# EAGLE design remote_V0_04_ (EAGLE 6.2)
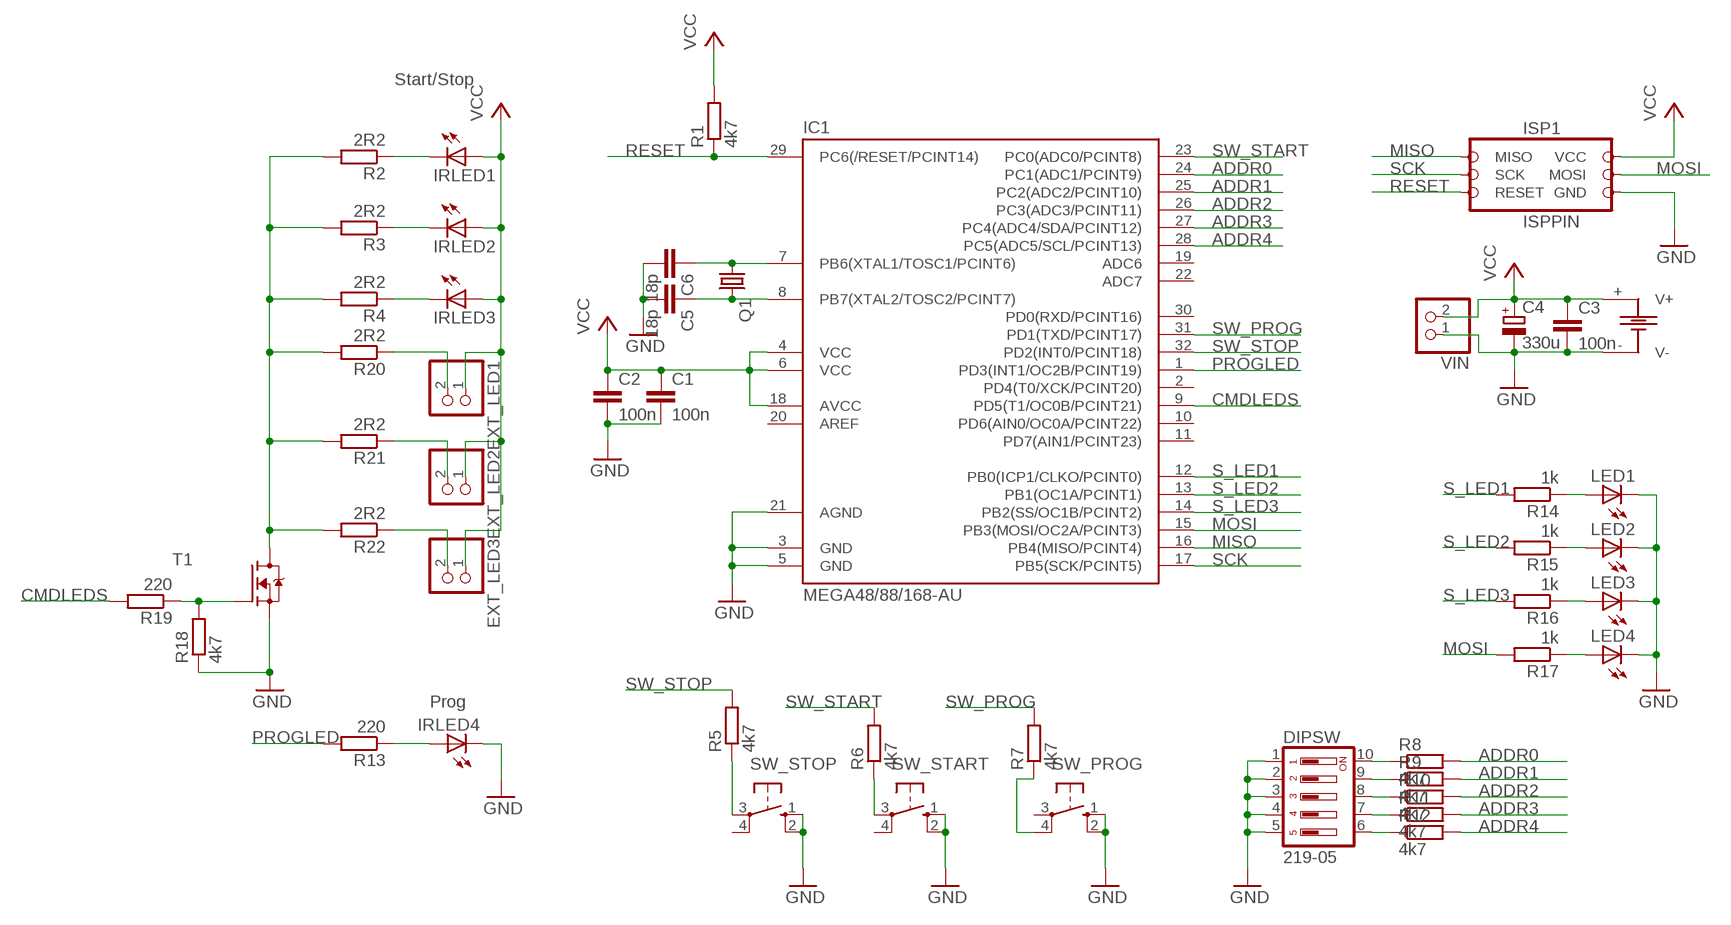
[diagram p0: schematic, sheet 1]

## Parts
B1  BATTERY_HOLDER_1  [BAT_HOLDER_1]
C1  100n  C-EUC0805WP  [C0805WP]
C2  100n  C-EUC0805WP  [C0805WP]
C3  100n  C-EUC0805WP  [C0805WP]
C4  330u  CPOL-EUSANYO_SMD_C6  [SANYO-OSCON_SMD_C6]
C5  18p  C-EUC0805WP  [C0805WP]
C6  18p  C-EUC0805WP  [C0805WP]
DIPSW  219-05  [CTS-219-05]
EXT_LED1  PINHD-1X2LONG  [1X2LONG]
EXT_LED2  PINHD-1X2LONG  [1X2LONG]
EXT_LED3  PINHD-1X2LONG  [1X2LONG]
IC1  MEGA48/88/168-AU  [TQFP32-08]
IRLED1  LEDLED5MMH  [LED5MMH]
IRLED2  LEDLED5MMH  [LED5MMH]
IRLED3  LEDLED5MMH  [LED5MMH]
IRLED4  LEDLED5MMH  [LED5MMH]
ISP1  ISPPIN  [2X03]
LED1  LED0805  [LED_0805]
LED2  LED0805  [LED_0805]
LED3  LED0805  [LED_0805]
LED4  LED0805  [LED_0805]
Q1  CRYSTALHC49S  [HC49/S]
R1  4k7  R-EU_R0805WP  [R0805WP]
R2  2R2  R-EU_R0805WP  [R0805WP]
R3  2R2  R-EU_R0805WP  [R0805WP]
R4  2R2  R-EU_R0805WP  [R0805WP]
R5  4k7  R-EU_R0805WP  [R0805WP]
R6  4k7  R-EU_R0805WP  [R0805WP]
R7  4k7  R-EU_R0805WP  [R0805WP]
R8  4k7  R-EU_R0805WP  [R0805WP]
R9  4k7  R-EU_R0805WP  [R0805WP]
R10  4k7  R-EU_R0805WP  [R0805WP]
R11  4k7  R-EU_R0805WP  [R0805WP]
R12  4k7  R-EU_R0805WP  [R0805WP]
R13  220  R-EU_R0805WP  [R0805WP]
R14  1k  R-EU_R0805WP  [R0805WP]
R15  1k  R-EU_R0805WP  [R0805WP]
R16  1k  R-EU_R0805WP  [R0805WP]
R17  1k  R-EU_R0805WP  [R0805WP]
R18  4k7  R-EU_R0805WP  [R0805WP]
R19  220  R-EU_R0805WP  [R0805WP]
R20  2R2  R-EU_R0805WP  [R0805WP]
R21  2R2  R-EU_R0805WP  [R0805WP]
R22  2R2  R-EU_R0805WP  [R0805WP]
SW_PROG  10-XX  [B3F-10XX]
SW_START  10-XX  [B3F-10XX]
SW_STOP  10-XX  [B3F-10XX]
T1  MOSFET_N_SOT23  [SOT23]
VIN  PINHD-1X2  [1X02]

## Nets
ADDR0: IC1.24(PC1(ADC1/PCINT9)) R8.2
ADDR1: IC1.25(PC2(ADC2/PCINT10)) R9.2
ADDR2: IC1.26(PC3(ADC3/PCINT11)) R10.2
ADDR3: IC1.27(PC4(ADC4/SDA/PCINT12)) R11.2
ADDR4: IC1.28(PC5(ADC5/SCL/PCINT13)) R12.2
CMDLEDS: IC1.9(PD5(T1/OC0B/PCINT21)) R19.2
GND: B1.-(V-) C1.2 C2.2 C3.2 C4.- C5.2 C6.2 DIPSW.1 DIPSW.2 DIPSW.3 DIPSW.4 DIPSW.5 IC1.3(GND) IC1.5(GND) IC1.21(AGND) IRLED4.P$2(C) ISP1.6(GND) LED1.C LED2.C LED3.C LED4.C R18.1 SW_PROG.1(S) SW_PROG.2(S1) SW_START.1(S) SW_START.2(S1) SW_STOP.1(S) SW_STOP.2(S1) T1.2(S) VIN.1
MISO: IC1.16(PB4(MISO/PCINT4)) ISP1.1(MISO)
MOSI: IC1.15(PB3(MOSI/OC2A/PCINT3)) ISP1.4(MOSI) R17.2
N$1: IRLED1.P$2(C) R2.1
N$2: IRLED2.P$2(C) R3.1
N$3: IRLED3.P$2(C) R4.1
N$4: DIPSW.10 R8.1
N$5: DIPSW.9 R9.1
N$6: DIPSW.8 R10.1
N$7: DIPSW.7 R11.1
N$8: DIPSW.6 R12.1
N$9: R5.1 SW_STOP.3(P)
N$10: R6.1 SW_START.3(P)
N$11: R7.1 SW_PROG.4(P1)
N$12: IRLED4.P$1(A) R13.1
N$13: R18.2 R19.1 T1.1(G)
N$14: LED1.A R14.1
N$15: LED2.A R15.1
N$16: LED3.A R16.1
N$17: LED4.A R17.1
N$18: C6.1 IC1.7(PB6(XTAL1/TOSC1/PCINT6)) Q1.1
N$19: EXT_LED1.2 R20.1
N$20: EXT_LED2.2 R21.1
N$21: R2.2 R3.2 R4.2 R20.2 R21.2 R22.2 T1.3(D)
N$22: EXT_LED3.2 R22.1
N$23: C5.1 IC1.8(PB7(XTAL2/TOSC2/PCINT7)) Q1.2
PROGLED: IC1.1(PD3(INT1/OC2B/PCINT19)) R13.2
RESET: IC1.29(PC6(/RESET/PCINT14)) ISP1.5(RESET) R1.1
S_LED1: IC1.12(PB0(ICP1/CLKO/PCINT0)) R14.2
S_LED2: IC1.13(PB1(OC1A/PCINT1)) R15.2
S_LED3: IC1.14(PB2(SS/OC1B/PCINT2)) R16.2
SCK: IC1.17(PB5(SCK/PCINT5)) ISP1.3(SCK)
SW_PROG: IC1.31(PD1(TXD/PCINT17)) R7.2
SW_START: IC1.23(PC0(ADC0/PCINT8)) R6.2
SW_STOP: IC1.32(PD2(INT0/PCINT18)) R5.2
VCC: B1.+(V+) C1.1 C2.1 C3.1 C4.+ EXT_LED1.1 EXT_LED2.1 EXT_LED3.1 IC1.4(VCC) IC1.6(VCC) IC1.18(AVCC) IRLED1.P$1(A) IRLED2.P$1(A) IRLED3.P$1(A) ISP1.2(VCC) R1.2 VIN.2
Unconnected: IC1.2(PD4(T0/XCK/PCINT20)) IC1.10(PD6(AIN0/OC0A/PCINT22)) IC1.11(PD7(AIN1/PCINT23)) IC1.19(ADC6) IC1.20(AREF) IC1.22(ADC7) IC1.30(PD0(RXD/PCINT16)) SW_PROG.3(P) SW_START.4(P1) SW_STOP.4(P1)

## Notes on the sheet
- Start/Stop
- Prog

## Library data of the parts
B1 = CRF:BATTERY_HOLDER: A battery holder A standard battery holder for AA-batteries (R6). http://se.mouser.com/ProductDetail/Eagle-Plastic-Devices/12BH212P-GR/?qs=GYzcNiWpw3f5BXsEPEtWIg%3d%3d
C1-C3 C5 C6 = rcl:C-EU: CAPACITOR, European symbol
C4 = rcl:CPOL-EU: POLARIZED CAPACITOR, European symbol
DIPSW = switch-dil:219-05*: Surface Mount DIP Switch Series 219 SMT CTS Electronic Components Sourc: www.ctscorp.com; OC_FARNELL: unknown; OC_NEWARK: unknown
EXT_LED1-EXT_LED3 = CRF:PINHD-1X2
IC1 = avr-7:MEGA48/88/168
IRLED1-IRLED4 = led:LED: LED OSRAM: - CHIPLED LG R971, LG N971, LY N971, LG Q971, LY Q971, LO R971, LY R971 LH N974, LH R974 LS Q976, LO Q976, LY Q976 LO Q996 - Hyper CHIPLED LW Q18S LB Q993, LB Q99A, LB R99A - SideLED LS A670, LO A670, LY A670, LG A670, LP A670 LB A673, LV A673, LT A673, LW A673 LH A674 LY A675 LS A676, LA A676, LO A676, LY A676, LW A676 LS A679, LY A679, LG A679 - Hyper Micro SIDELED® LS Y876, LA Y876, LO Y876, LY Y876 LT Y87S - SmartLED LW L88C, LW L88S LB L89C, LB L89S, LG L890 LS L89K, LO L89K, LY L89K LS L896, LA L896, LO L896, LY L896 - TOPLED LS T670, LO T670, LY T670, LG T670, LP T670 LSG T670, LSP T670, LSY T670, LOP T670, LYG T670 LG T671, LOG T671, LSG T671 LB T673, LV T673, LT T673, LW T673 LH T674 LS T676, LA T676, LO T676, LY T676, LB T676, LH T676, LSB T676, LW T676 LB T67C, LV T67C, LT T67C, LS T67K, LO T67K, LY T67K, LW E67C LS E67B, LA E67B, LO E67B, LY E67B, LB E67C, LV E67C, LT E67C LW T67C LS T679, LY T679, LG T679 LS T770, LO T770, LY T770, LG T770, LP T770 LB T773, LV T773, LT T773, LW T773 LH T774 LS E675, LA E675, LY E675, LS T675 LS T776, LA T776, LO T776, LY T776, LB T776 LHGB T686 LT T68C, LB T68C - Hyper Mini TOPLED® LB M676 - Mini TOPLED Santana® LG M470 LS M47K, LO M47K, LY M47K Source: http://www.osram.convergy.de - LUMILED® LXK2-PW12-R00, LXK2-PW12-S00, LXK2-PW14-U00, LXK2-PW14-V00 LXK2-PM12-R00, LXK2-PM12-S00, LXK2-PM14-U00 LXK2-PE12-Q00, LXK2-PE12-R00, LXK2-PE12-S00, LXK2-PE14-T00, LXK2-PE14-U00 LXK2-PB12-K00, LXK2-PB12-L00, LXK2-PB12-M00, LXK2-PB14-N00, LXK2-PB14-P00, LXK2-PB14-Q00 LXK2-PR12-L00, LXK2-PR12-M00, LXK2-PR14-Q00, LXK2-PR14-R00 LXK2-PD12-Q00, LXK2-PD12-R00, LXK2-PD12-S00 LXK2-PH12-R00, LXK2-PH12-S00 LXK2-PL12-P00, LXK2-PL12-Q00, LXK2-PL12-R00 Source: www.luxeon.com
ISP1 = CRF:ISP: Programming connector for ATmel microcontrollers
LED1-LED4 = CRF:LED: LED OSRAM: - CHIPLED LG R971, LG N971, LY N971, LG Q971, LY Q971, LO R971, LY R971 LH N974, LH R974 LS Q976, LO Q976, LY Q976 LO Q996 - Hyper CHIPLED LW Q18S LB Q993, LB Q99A, LB R99A - SideLED LS A670, LO A670, LY A670, LG A670, LP A670 LB A673, LV A673, LT A673, LW A673 LH A674 LY A675 LS A676, LA A676, LO A676, LY A676, LW A676 LS A679, LY A679, LG A679 - Hyper Micro SIDELED® LS Y876, LA Y876, LO Y876, LY Y876 LT Y87S - SmartLED LW L88C, LW L88S LB L89C, LB L89S, LG L890 LS L89K, LO L89K, LY L89K LS L896, LA L896, LO L896, LY L896 - TOPLED LS T670, LO T670, LY T670, LG T670, LP T670 LSG T670, LSP T670, LSY T670, LOP T670, LYG T670 LG T671, LOG T671, LSG T671 LB T673, LV T673, LT T673, LW T673 LH T674 LS T676, LA T676, LO T676, LY T676, LB T676, LH T676, LSB T676, LW T676 LB T67C, LV T67C, LT T67C, LS T67K, LO T67K, LY T67K, LW E67C LS E67B, LA E67B, LO E67B, LY E67B, LB E67C, LV E67C, LT E67C LW T67C LS T679, LY T679, LG T679 LS T770, LO T770, LY T770, LG T770, LP T770 LB T773, LV T773, LT T773, LW T773 LH T774 LS E675, LA E675, LY E675, LS T675 LS T776, LA T776, LO T776, LY T776, LB T776 LHGB T686 LT T68C, LB T68C - Hyper Mini TOPLED® LB M676 - Mini TOPLED Santana® LG M470 LS M47K, LO M47K, LY M47K Source: http://www.osram.convergy.de - LUMILED® LXK2-PW12-R00, LXK2-PW12-S00, LXK2-PW14-U00, LXK2-PW14-V00 LXK2-PM12-R00, LXK2-PM12-S00, LXK2-PM14-U00 LXK2-PE12-Q00, LXK2-PE12-R00, LXK2-PE12-S00, LXK2-PE14-T00, LXK2-PE14-U00 LXK2-PB12-K00, LXK2-PB12-L00, LXK2-PB12-M00, LXK2-PB14-N00, LXK2-PB14-P00, LXK2-PB14-Q00 LXK2-PR12-L00, LXK2-PR12-M00, LXK2-PR14-Q00, LXK2-PR14-R00 LXK2-PD12-Q00, LXK2-PD12-R00, LXK2-PD12-S00 LXK2-PH12-R00, LXK2-PH12-S00 LXK2-PL12-P00, LXK2-PL12-Q00, LXK2-PL12-R00 Source: www.luxeon.com
Q1 = crystal:CRYSTAL: CRYSTAL; OC_FARNELL: 1667008; OC_NEWARK: unknown
R1-R22 = rcl:R-EU_: RESISTOR, European symbol
SW_PROG SW_START SW_STOP = switch-omron:10-XX: OMRON SWITCH; MPN: B3F-1000; OC_FARNELL: 176432; OC_NEWARK: 36M3542
T1 = CRF:MOSFET_N: Just a standard MOSFET Can be used as a placeholder for any MOSFET, when it does not matter that much one is used.
VIN = pinhead:PINHD-1X2: PIN HEADER

## Board
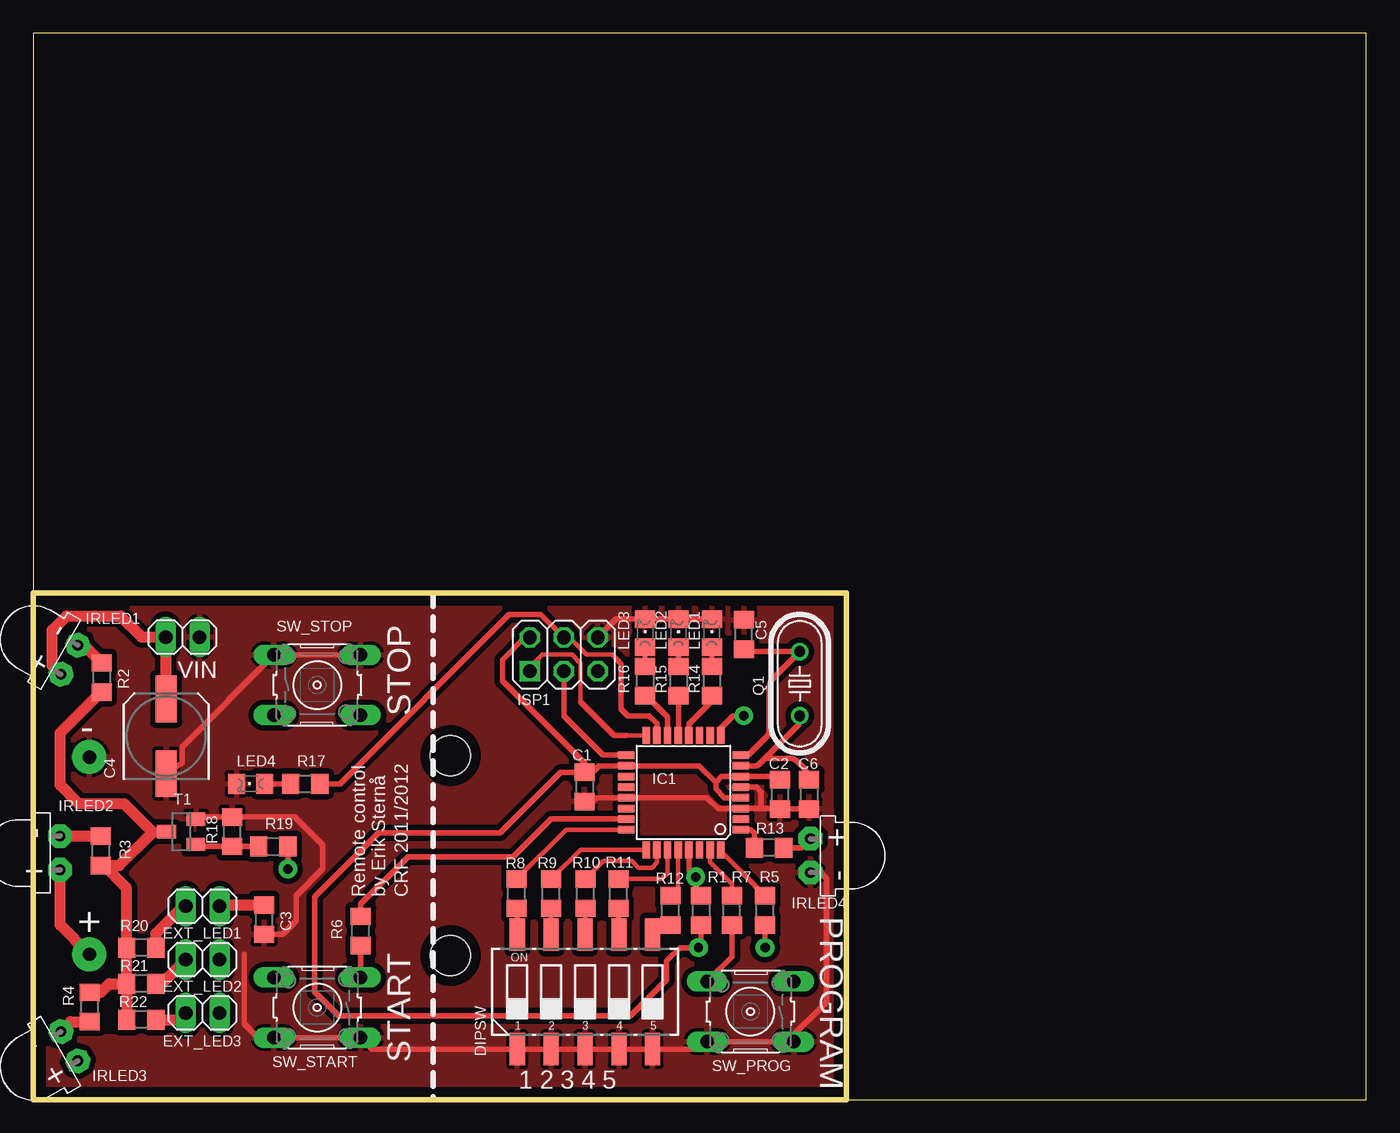
[diagram p1: board, top side]
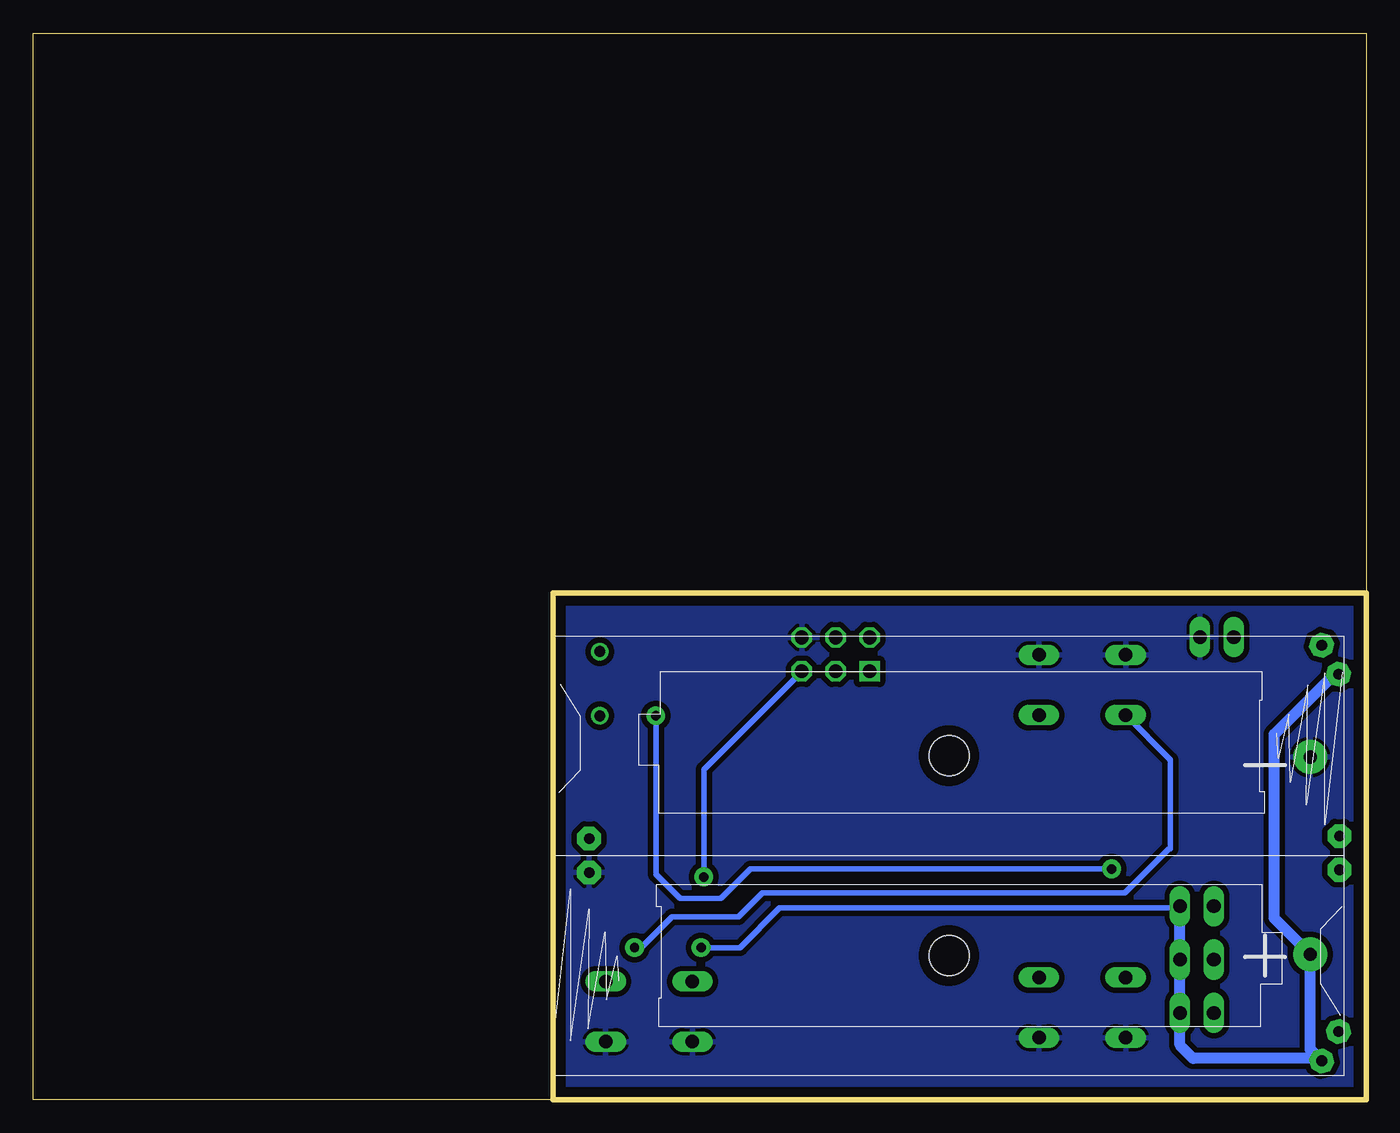
[diagram p2: board, bottom side, seen from below]

Size 100 x 80 mm. Coordinates in mm from the lower left corner, seen from the top.
Outline: 61,0 100,0 100,80 0,80 0,50 0,38
Outline: 61,0 0,0 0,38
Outline: 61,0 61,38 0,38
Copper layers (1*16): Top 0.035mm / dielectric 1.5mm / Bottom 0.035mm
Design rules "default *": minimum track width 0.3mm, minimum drill 0.6mm, track to track 0.3mm, track to pad 0.3mm, pad to pad 0.3mm, via to via 0.3mm, smd to smd 0mil, copper to edge 30mil, drill to drill 8mil, minimum pad ring 10mil, minimum via ring 8mil, stop-mask expansion 4mil, vias tented up to drill 0mil, thermal gap 10mil
tRestrict: area 46.5,34.6 to 50.3,35.2; area 12.8,19.8 to 14.5,20.4; area 4.7,5.5 to 6.6,6

### Footprints (pad centres in the part's own frame; a part is rotated, then mirrored left to right if it is on the bottom)
BAT_HOLDER_1 = drill 1 pad 2.54: + -27.1,7.4; - -27.1,-7.4 | hole 3: 0,7.5; 0,-7.5
C0805WP = smd 1.3 x 1.5: 1 -1.1,0; 2 1.1,0
SANYO-OSCON_SMD_C6 = smd 3.5 x 1.6: + 2.8,0; - -2.8,0
CTS-219-05 = smd 1.13 x 2.44: 1 -5.08,-4.3; 2 -2.54,-4.3; 3 0,-4.3; 4 2.54,-4.3; 5 5.08,-4.3; 6 5.08,4.3; 7 2.54,4.3; 8 0,4.3; 9 -2.54,4.3; 10 -5.08,4.3
1X2LONG = drill 1.016 pad 1.422 long: 1 -1.27,0; 2 1.27,0
TQFP32-08 = smd 1.27 x 0.559: 1 -4.293,2.8; 2 -4.293,2; 3 -4.293,1.2; 4 -4.293,0.4; 5 -4.293,-0.4; 6 -4.293,-1.2; 7 -4.293,-2; 8 -4.293,-2.8; 17 4.293,-2.8; 18 4.293,-2; 19 4.293,-1.2; 20 4.293,-0.4; 21 4.293,0.4; 22 4.293,1.2; 23 4.293,2; 24 4.293,2.8 | smd 0.559 x 1.27: 9 -2.8,-4.293; 10 -2,-4.293; 11 -1.2,-4.293; 12 -0.4,-4.293; 13 0.4,-4.293; 14 1.2,-4.293; 15 2,-4.293; 16 2.8,-4.293; 25 2.8,4.293; 26 2,4.293; 27 1.2,4.293; 28 0.4,4.293; 29 -0.4,4.293; 30 -1.2,4.293; 31 -2,4.293; 32 -2.8,4.293
LED5MMH = drill 0.8 pad 1.778 octagon: P$1 -1.27,0; P$2 1.27,0
2X03 = drill 1.016 square: 1 -2.54,-1.27 | drill 1.016 octagon: 2 -2.54,1.27; 3 0,-1.27; 4 0,1.27; 5 2.54,-1.27; 6 2.54,1.27
LED_0805 = smd 1.5 x 1.3: A 0,-1.05; C 0,1.05
HC49/S = drill 0.813: 1 -2.413,0; 2 2.413,0
R0805WP = smd 1.3 x 1.5: 1 -1.1,0; 2 1.1,0
B3F-10XX = drill 1.016 long: 1 -3.251,2.261; 2 3.251,2.261; 3 -3.251,-2.261; 4 3.251,-2.261
SOT23 = smd 1 x 1.4: 1 -0.95,-1.1; 2 0.95,-1.1; 3 0,1.1
1X02 = drill 1.016 long: 1 -1.27,0; 2 1.27,0

### Placement (x,y rotation side)
B1  31.3,18.3 180 bottom
C1  41.35,23.46 270 top
C2  56,22.9 270 top
C3  17.3,13.5 270 top
C4  9.97,27.26 90 top
C5  53.3,34.9 90 top
C6  58.2,22.9 270 top
DIPSW  41.39,8.08 0 top
EXT_LED1  12.7,14.5 180 top
EXT_LED2  12.7,10.5 180 top
EXT_LED3  12.7,6.5 180 top
IC1  48.78,23.04 180 top
IRLED1  2.7,33 60 top
IRLED2  2,18.5 90 top
IRLED3  2.7,4 120 top
IRLED4  58.3,18.3 270 top
ISP1  39.8,33.4 0 top
LED1  50.9,35 0 top
LED2  48.4,35 0 top
LED3  45.9,35 0 top
LED4  16.3,23.7 90 top
Q1  57.5,31.2 90 top
R1  50.1,14.2 270 top
R2  5.12,31.66 270 top
R3  5.04,18.66 270 top
R4  4.24,6.94 90 top
R5  54.9,14.2 90 top
R6  24.57,12.64 90 top
R7  52.4,14.2 90 top
R8  36.26,15.44 90 top
R9  38.84,15.44 90 top
R10  41.42,15.44 90 top
R11  43.9,15.44 90 top
R12  47.8,14.2 90 top
R13  55.2,18.9 180 top
R14  50.9,31.4 270 top
R15  48.4,31.4 270 top
R16  45.9,31.4 270 top
R17  20.4,23.7 0 top
R18  14.9,20.1 270 top
R19  18,19 0 top
R20  8.1,11.4 180 top
R21  8.1,8.7 180 top
R22  8.1,6 180 top
SW_PROG  53.8,6.6 180 top
SW_START  21.3,6.9 180 top
SW_STOP  21.3,31.1 0 top
T1  11.1,20.1 90 top
VIN  11.2,34.7 180 top

### Tracks (layer width: path | path; a pad name or v marks a point on that pad's centre or on a via)
ADDR0
  Top 0.35: R8.2 39.96,20.24 IC1.24
ADDR1
  Top 0.35: R9.2 41.05,18.75 IC1.25
ADDR2
  Top 0.35: R10.2 42.78,17.9 44.9,17.9 45.4,17.4 46.4,17.4 46.78,17.78 IC1.26
ADDR3
  Top 0.35: IC1.27 47.58,16.98 47.14,16.54 R11.2
ADDR4
  Top 0.35: IC1.28 48.38,15.88 R12.2
  Top 0.406: R12.2 47.58,15.64
CMDLEDS  (via drill 0.7 pad 1.42)
  Top 0.406: v19.1,17.3 R19.2 | IC1.9 51.58,27.88 52.5,28.8 v53.3,28.8
  Bottom 0.406: v53.3,28.8 53.3,16.9 51.5,15.1 48.4,15.1 46.2,17.3 v19.1,17.3
GND
  Top 0.406: C4.- 11.16,25.26 11.16,26.47 SW_STOP.1 SW_STOP.2 | LED1.C LED2.C LED3.C 43.72,36.05 ISP1.6 | 54.6,21.86 53.09,21.86 IC1.3 51.36,21.84 50.56,22.64 IC1.21 42.23,22.64 41.95,22.36 C1.2 | IC1.5 54.26,23.44 54.6,23.1 54.6,21.86 | C2.2 55.9,21.59 | T1.2 12.35,21.2 R18.1 19.6,21.2 21.7,19.1 21.7,17.3 19.7,15.3 19.7,13.4 18.7,12.4 C3.2 17.31,12.31 | 54.6,21.86 55.94,21.86 C2.2 | C2.2 C6.2 | 15.8,10.9 15.8,5.7 16.86,4.64 SW_START.2 SW_START.1 25.41,3.78 DIPSW.1 DIPSW.2 DIPSW.3 DIPSW.4 DIPSW.5 49.49,3.78 SW_PROG.2 SW_PROG.1 56.55,4.35 59.5,7.3 59.5,16.6 59.1,17
  Top 0.813: 4.64,25.26 B1.-
  pour Bottom (isolate 0.406): 0.2,39.6 66,39.6 66,-1.1 0.2,-1.1
  pour Top (isolate 0.406): 0.2,38.8 65.1,38.8 65.1,-0.5 0.2,-0.5
MISO
  Top 0.35: 44.47,27.33 IC1.16 | 41.07,29.83 41.07,32.73 40.4,33.4 38.2,33.4 37.26,32.46 ISP1.1
  Top 0.406: 44.47,27.33 43.57,27.33 41.07,29.83
MOSI
  Top 0.35: 43.7,33.1 43.4,33.4 41.5,33.4 40.23,34.67 ISP1.4
  Top 0.406: IC1.15 46.78,28.22 46.2,28.8 44.6,28.8 44.1,29.3 44.1,32.7 43.7,33.1 | ISP1.4 38.07,36.4 35.7,36.4 23,23.7 R17.2
N$1
  Top 0.813: IRLED1.P$2 3.78,34.1 R2.1
N$2
  Top 0.813: IRLED2.P$2 R3.1
N$3
  Top 0.813: IRLED3.P$2 2.81,5.84 R4.1
N$4
  Top 0.406: DIPSW.10 36.31,14.29 R8.1
N$5
  Top 0.406: DIPSW.9 R9.1
N$6
  Top 0.406: DIPSW.8 41.39,14.31 R10.1
N$7
  Top 0.406: DIPSW.7 43.9,12.41 R11.1
N$8
  Top 0.406: DIPSW.6 47.23,13.14 R12.1
N$9  (via drill 0.7 pad 1.42)
  Top 0.406: v54.9,11.4 R5.1
  Bottom 0.406: SW_STOP.3 14.7,25.49 14.7,18.8 14.8,18.8 18.1,15.5 45.3,15.5 47.1,13.7 52.1,13.7 54.4,11.4 v54.9,11.4
N$10
  Top 0.406: R6.1 24.55,11.52 SW_START.3
N$11
  Top 0.406: R7.1 52.4,10.71 SW_PROG.4
N$12
  Top 0.406: R13.1 57.63,18.9 IRLED4.P$1
N$13
  Top 0.406: T1.1 12.35,19 R18.2 R19.1
N$14
  Top 0.406: R14.1 LED1.A
N$15
  Top 0.406: R15.1 LED2.A
N$16
  Top 0.406: R16.1 LED3.A
N$17
  Top 0.406: LED4.A R17.1
N$18
  Top 0.406: IC1.7 54.22,25.04 arc45 54.43,25.13 54.9,25.6 | 54.9,25.6 57.38,28.08 arc45 57.5,28.37 Q1.1 | 54.9,25.6 56.78,25.6 arc-45 57.32,25.38 57.81,24.89 arc-45 58,24.43 C6.1
N$19
  Top 0.813: R20.1 9.2,12.47 11.23,14.5 EXT_LED1.2
N$20
  Top 0.813: 11.43,10.53 EXT_LED2.2 9.63,8.7 R21.1
N$21
  Top 0.813: R21.2 5.7,8.7 5.04,8.04 R4.2 4.14,7.94 | R21.2 R20.2 7,15.86 5.3,17.56 | R21.2 R22.2 | 5.3,17.56 R3.2 | 5.3,17.56 6.46,17.56 8.9,20 8.9,20.1 | 8.9,20.1 6.8,22.2 3.4,22.2 2,23.6 2,27.5 5.06,30.56 R2.2 | 8.9,20.1 T1.3
N$22
  Top 0.813: R22.1 10.93,6 EXT_LED3.2
N$23
  Top 0.406: IC1.8 53.64,25.84 54.99,27.19 arc45 55.2,27.7 55.2,30.85 arc-45 55.53,31.64 Q1.2 53.6,33.61 53.41,33.8 C5.1
PROGLED
  Top 0.406: IC1.1 53.86,20.24 54.1,20 R13.2
RESET  (via drill 0.7 pad 1.42)
  Top 0.406: 49.9,15.3 R1.1 49.7,15.7 v49.7,16.7 49.18,17.22 IC1.29
  Bottom 0.406: 49.7,16.8 v49.7,16.7 49.7,24.77 ISP1.5
S_LED1
  Top 0.406: IC1.12 49.18,28.18 50.9,29.9 R14.2
S_LED2
  Top 0.305: R15.2 48.4,30.4
  Top 0.406: IC1.13 48.4,27.35 R15.2
S_LED3
  Top 0.406: IC1.14 47.58,28.72 46,30.3 R16.2
SCK
  Top 0.406: ISP1.3 39.8,28.8 42.76,25.84 IC1.17
SW_PROG
  Top 0.35: IC1.31 50.78,17.82 52.4,16.2 R7.2
SW_START
  Top 0.406: IC1.23 38.84,21.04 36,18.2 28.1,18.2 24.57,14.67 R6.2
SW_STOP
  Top 0.35: IC1.32 51.58,18.62 53.3,16.9
  Top 0.406: 54.6,15.4 R5.2 53.3,16.9
VCC  (via drill 0.7 pad 1.42)
  Top 0.406: IC1.4 51.86,22.64 51.2,23.3 51.2,23.8 | 51.2,23.8 51.64,24.24 IC1.6 55.99,24.24 C2.1 | 51.2,23.8 49.96,25.04 IC1.18 42.43,25.04 41.95,24.56 C1.1 | R1.2 50.1,11.6 v49.9,11.4 48.5,11.4 47.5,10.4 47.5,9 44.8,6.3 22.9,6.3 21.1,8.1 21.1,15.2 25.9,20 35,20 39.56,24.56 C1.1 | ISP1.2 36.87,34.67 35.2,33 35.2,31.4 41.35,25.25 C1.1
  Top 0.813: IRLED2.P$1 2,13.1 B1.+ | EXT_LED1.1 14.07,14.6 C3.1 | C4.+ 9.93,30.1 VIN.2 8.13,34.7 6.53,36.3 2.5,36.3 1.4,35.2 1.4,32.56 IRLED1.P$1
  Bottom 0.406: 13.97,14.37 44.03,14.37 47,11.4 v49.9,11.4
  Bottom 0.813: EXT_LED1.1 13.97,14.37 EXT_LED2.1 EXT_LED3.1 13.97,4.07 12.99,3.09 3.52,3.09 | IRLED3.P$1 3.52,3.09 | 3.52,3.09 4.2,3.77 B1.+ 6.9,13.6 6.9,27.4 2.4,31.9 IRLED1.P$1

### Text on the board
tPlace: STOP | Remote control | by Erik Sternå | CRF 2011/2012 | PROGRAM | START | 1 2 3 4 5
tNames: - | +